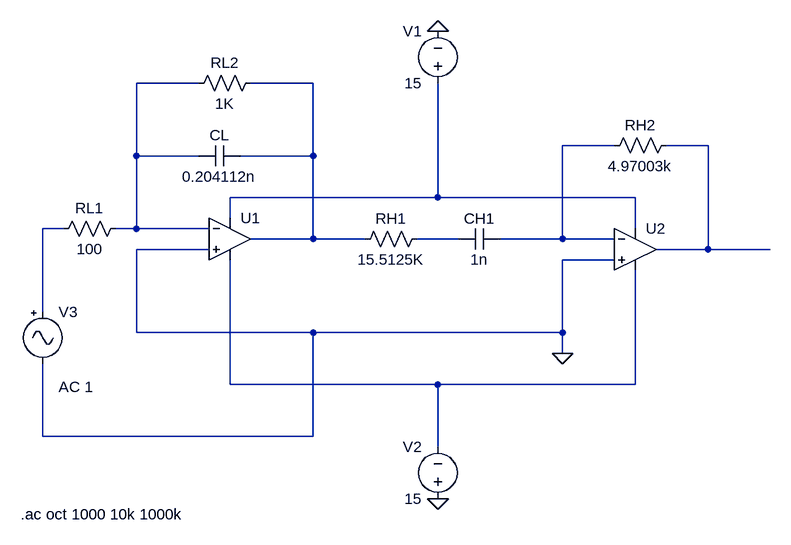
[diagram p0: schematic Band pass filter-schematic.asc]
Band pass filter-schematic.asc, the LTspice schematic file:
Version 4
SHEET 1 996 680
WIRE 112 -96 16 -96
WIRE 288 -96 192 -96
WIRE 752 0 672 0
WIRE 896 0 832 0
WIRE 16 16 16 -96
WIRE 112 16 16 16
WIRE 288 16 288 -96
WIRE 288 16 176 16
WIRE 480 80 480 -96
WIRE 480 80 160 80
WIRE 784 80 480 80
WIRE 160 112 160 80
WIRE -96 128 -128 128
WIRE 16 128 16 16
WIRE 16 128 -16 128
WIRE 128 128 16 128
WIRE 784 128 784 80
WIRE 288 144 288 16
WIRE 288 144 192 144
WIRE 368 144 288 144
WIRE 512 144 448 144
WIRE 672 144 672 0
WIRE 672 144 576 144
WIRE 752 144 672 144
WIRE 128 160 16 160
WIRE 896 160 896 0
WIRE 896 160 816 160
WIRE 992 160 896 160
WIRE 752 176 672 176
WIRE -128 256 -128 128
WIRE 16 288 16 160
WIRE 288 288 16 288
WIRE 672 288 672 176
WIRE 672 288 288 288
WIRE 672 320 672 288
WIRE 160 368 160 176
WIRE 480 368 160 368
WIRE 784 368 784 192
WIRE 784 368 480 368
WIRE -128 448 -128 336
WIRE 288 448 288 288
WIRE 288 448 -128 448
WIRE 480 464 480 368
FLAG 672 320 0
FLAG 480 -176 0
FLAG 480 544 0
SYMBOL OpAmps\\UniversalOpAmp2 160 144 R0
SYMATTR InstName U1
SYMATTR Value2 Avol=1Meg GBW=100G Slew=10Meg
SYMBOL OpAmps\\UniversalOpAmp2 784 160 R0
SYMATTR InstName U2
SYMATTR Value2 Avol=1Meg GBW=100G Slew=10Meg
SYMBOL cap 176 0 R90
WINDOW 0 0 32 VBottom 2
WINDOW 3 32 32 VTop 2
SYMATTR InstName CL
SYMATTR Value 0.204112n
SYMBOL cap 576 128 R90
WINDOW 0 0 32 VBottom 2
WINDOW 3 32 32 VTop 2
SYMATTR InstName CH1
SYMATTR Value 1n
SYMBOL res 464 128 R90
WINDOW 0 0 56 VBottom 2
WINDOW 3 32 56 VTop 2
SYMATTR InstName RH1
SYMATTR Value 15.5125K
SYMBOL res 208 -112 R90
WINDOW 0 0 56 VBottom 2
WINDOW 3 32 56 VTop 2
SYMATTR InstName RL2
SYMATTR Value 1K
SYMBOL res 0 112 R90
WINDOW 0 0 56 VBottom 2
WINDOW 3 32 56 VTop 2
SYMATTR InstName RL1
SYMATTR Value 100
SYMBOL res 848 -16 R90
WINDOW 0 0 56 VBottom 2
WINDOW 3 32 56 VTop 2
SYMATTR InstName RH2
SYMATTR Value 4.97003k
SYMBOL voltage 480 -80 R180
WINDOW 0 24 96 Left 2
WINDOW 3 24 16 Left 2
WINDOW 123 0 0 Left 0
WINDOW 39 0 0 Left 0
SYMATTR InstName V1
SYMATTR Value 15
SYMBOL voltage 480 560 R180
WINDOW 0 24 96 Left 2
WINDOW 3 24 16 Left 2
WINDOW 123 0 0 Left 0
WINDOW 39 0 0 Left 0
SYMATTR InstName V2
SYMATTR Value 15
SYMBOL Misc\\signal -128 240 R0
WINDOW 123 24 132 Left 2
WINDOW 39 0 0 Left 0
SYMATTR InstName V3
SYMATTR Value ""
SYMATTR Value2 AC 1
TEXT -162 568 Left 2 !.ac oct 1000 10k 1000k

The netlist it stands for:
* Band pass filter-schematic.asc
XU1 0 N001 N005 N008 N002 level2 Avol=1Meg GBW=100G Slew=10Meg Ilimit=25m Rail=0 Vos=0 En=0 Enk=0 In=0 Ink=0 Rin=500Meg  ; pins In+ In- V+ V- OUT
XU2 0 N003 N005 N008 N004 level2 Avol=1Meg GBW=100G Slew=10Meg Ilimit=25m Rail=0 Vos=0 En=0 Enk=0 In=0 Ink=0 Rin=500Meg  ; pins In+ In- V+ V- OUT
CL N002 N001 0.204112n
CH1 N003 N007 1n
RH1 N007 N002 15.5125K
RL2 N002 N001 1K
RL1 N001 N006 100
RH2 N004 N003 4.97003k
V1 N005 0 15
V2 0 N008 15
V3 N006 0 AC 1
.ac oct 1000 10k 1000k
.lib UniversalOpAmp2.lib
.backanno
.end